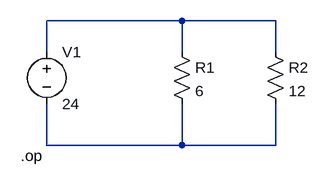
[diagram p0: schematic circuit.asc]
circuit.asc, the LTspice schematic file:
Version 4.1
SHEET 1 880 680
WIRE 320 96 112 96
WIRE 464 96 320 96
WIRE 112 144 112 96
WIRE 320 144 320 96
WIRE 464 144 464 96
WIRE 112 288 112 224
WIRE 320 288 320 224
WIRE 320 288 112 288
WIRE 464 288 464 224
WIRE 464 288 320 288
SYMBOL voltage 112 128 R0
SYMATTR InstName V1
SYMATTR Value 24
SYMBOL res 304 128 R0
SYMATTR InstName R1
SYMATTR Value 6
SYMBOL res 448 128 R0
SYMATTR InstName R2
SYMATTR Value 12
TEXT 72 304 Left 2 !.op

The netlist it stands for:
* circuit.asc
V1 N001 N002 24
R1 N001 N002 6
R2 N001 N002 12
.op
.backanno
.end